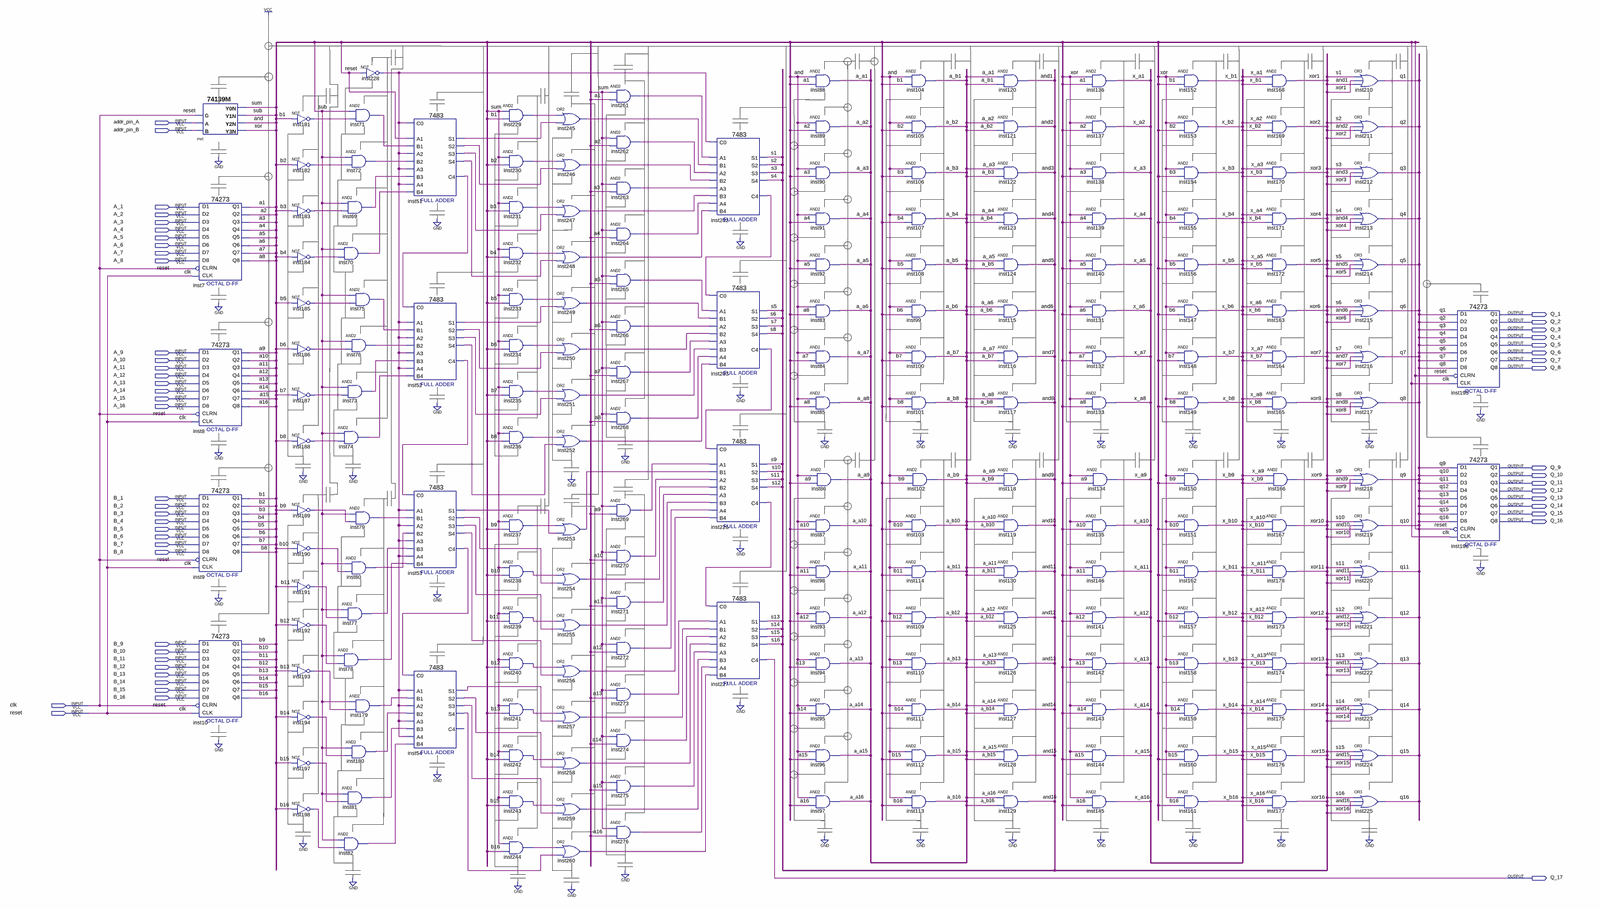
[diagram p0: schematic sheet, whole]
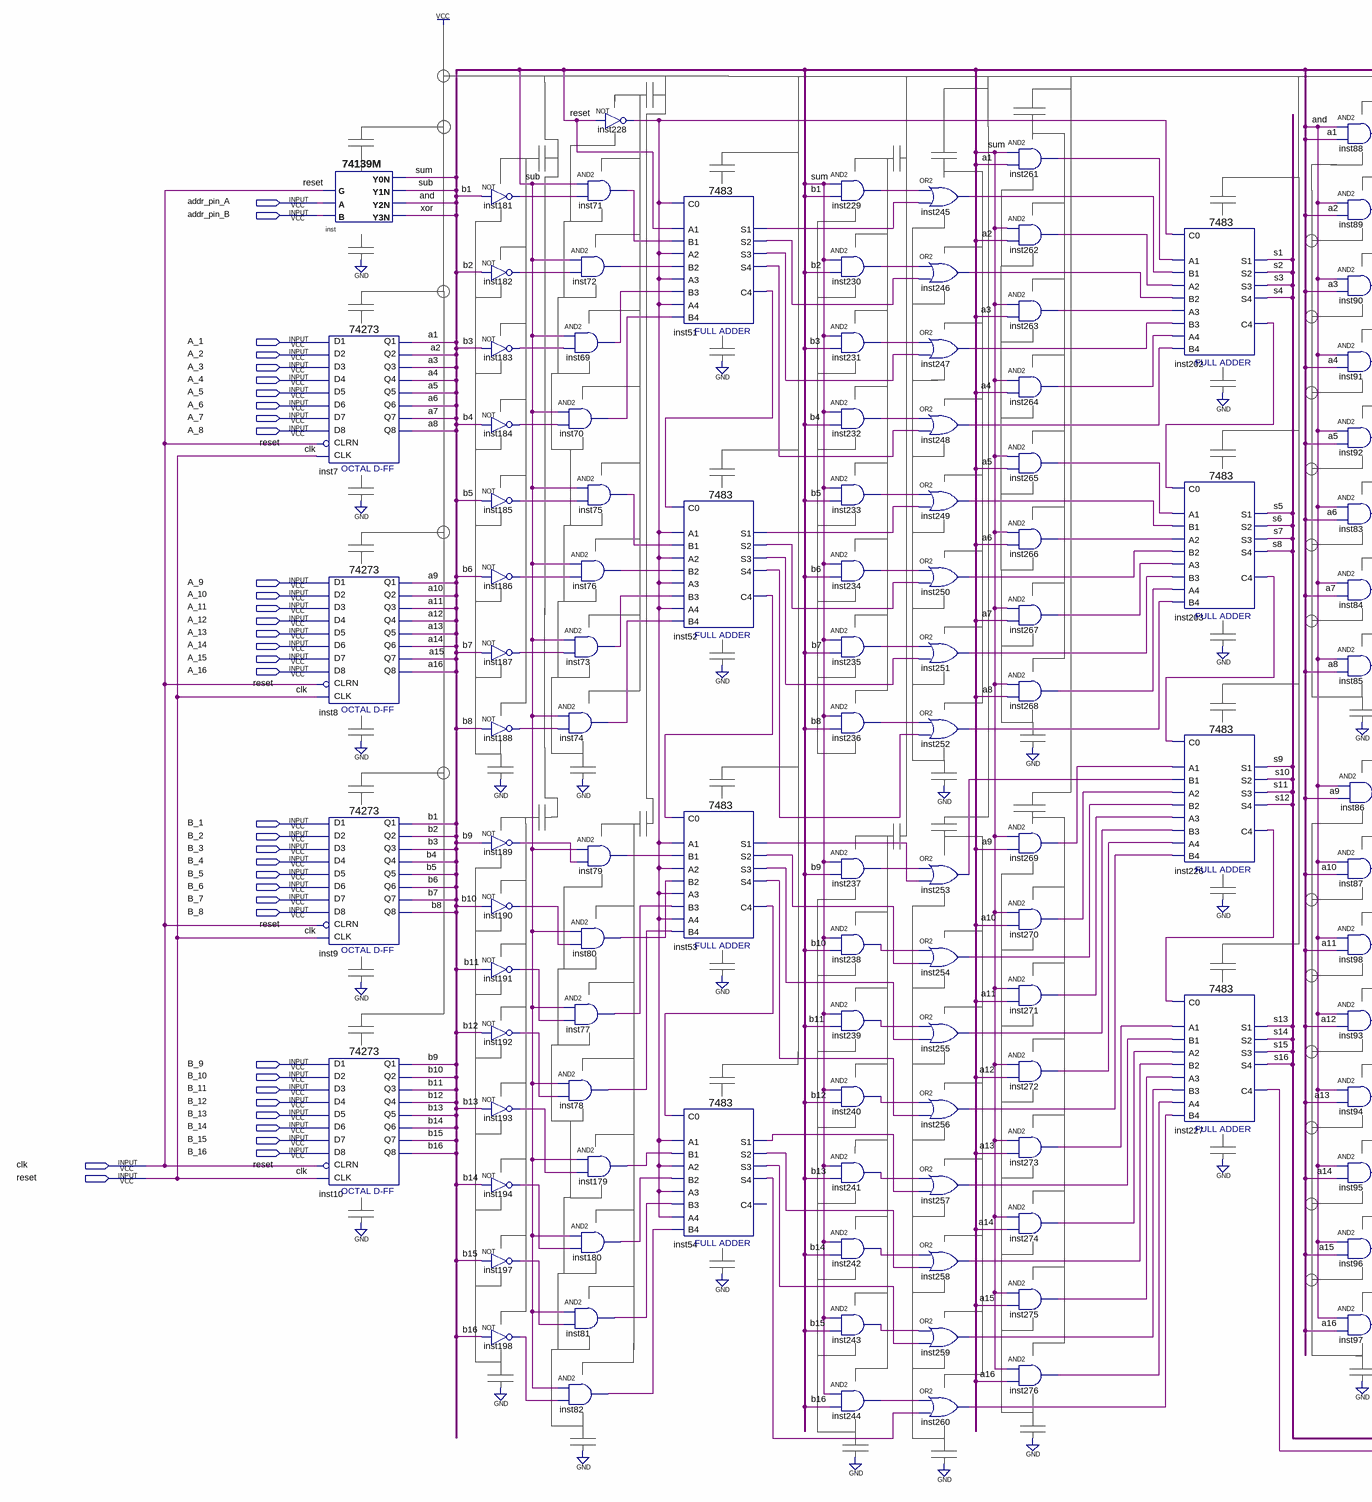
[diagram p1: schematic sheet, left part]
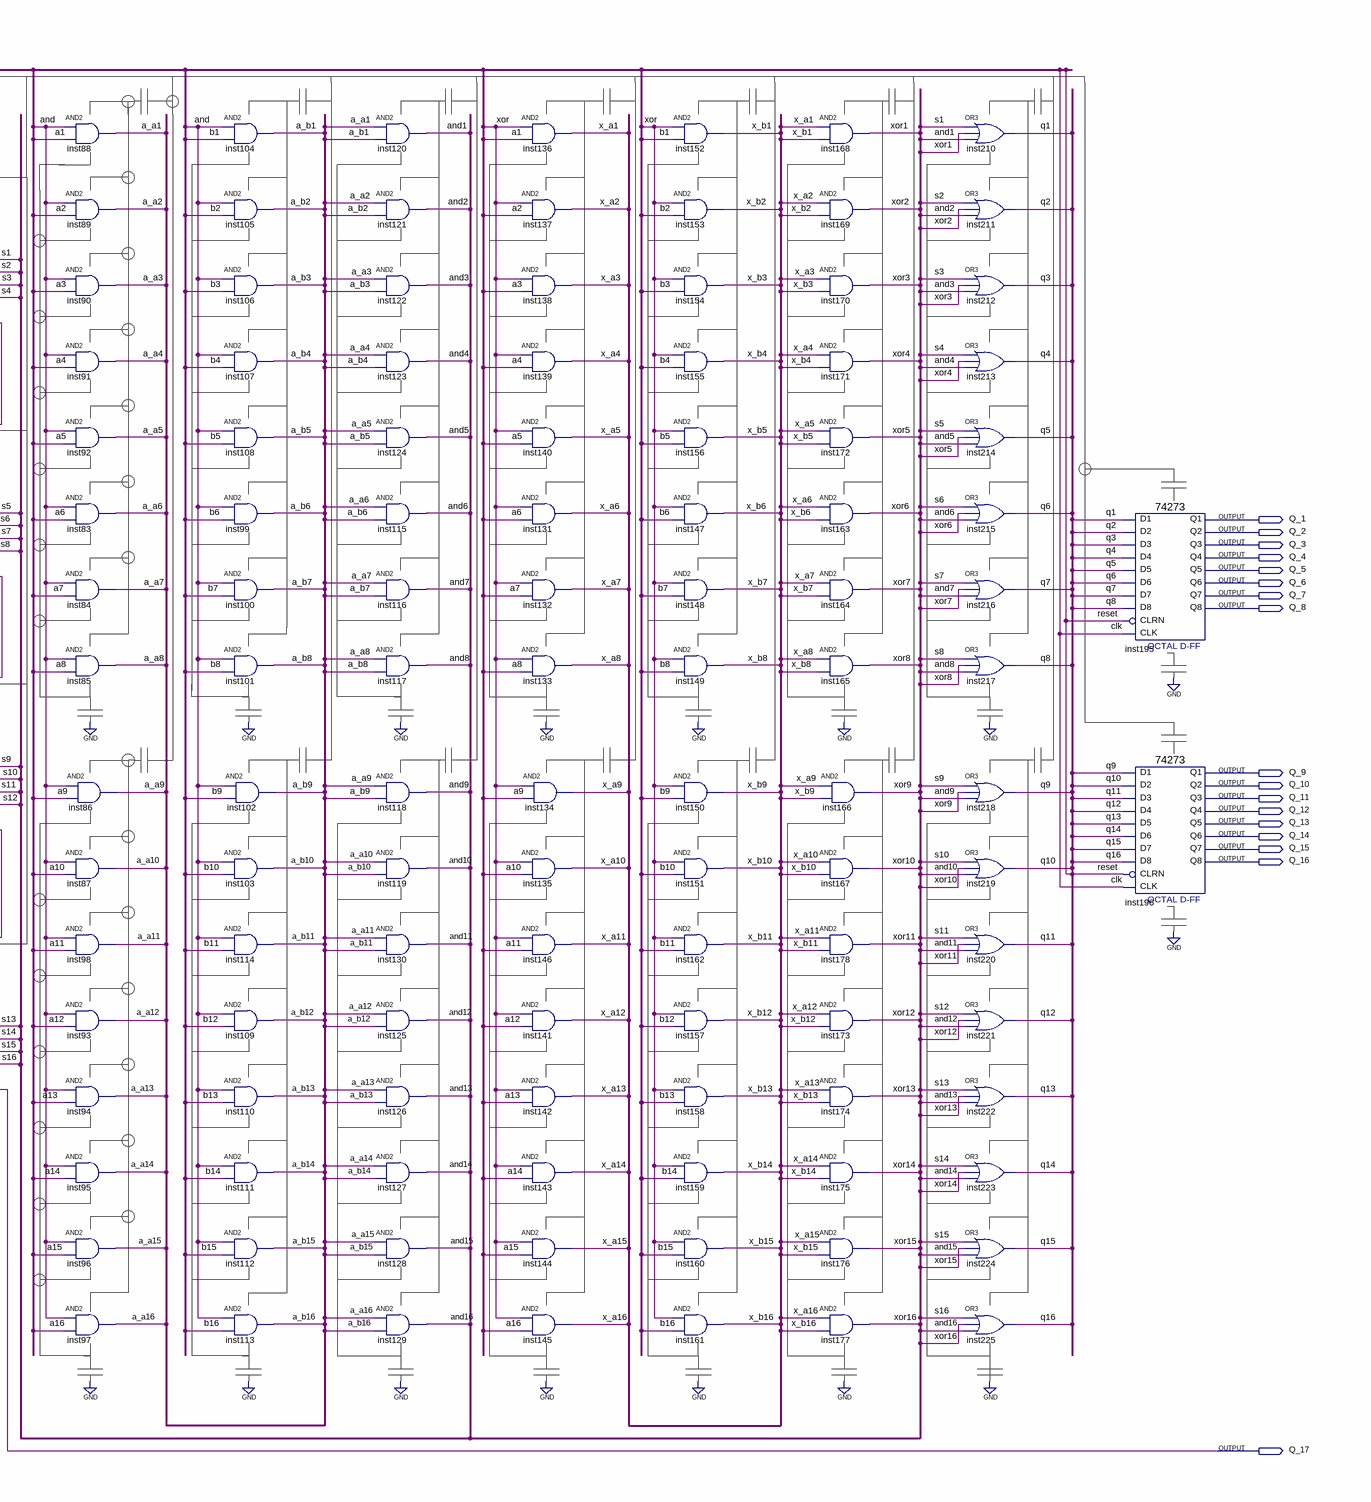
[diagram p2: schematic sheet, right part]
// Quartus schematic Приложение В.bdf as structural Verilog: 208 symbols, 53 pins
module \Приложение_В  (
  input  addr_pin_A,
  input  addr_pin_B,
  input  A_1,
  input  A_2,
  input  A_3,
  input  A_4,
  input  A_5,
  input  A_6,
  input  A_7,
  input  A_8,
  input  A_9,
  input  A_10,
  input  A_11,
  input  A_12,
  input  A_13,
  input  A_14,
  input  A_15,
  input  A_16,
  input  B_1,
  input  B_2,
  input  B_3,
  input  B_4,
  input  B_5,
  input  B_6,
  input  B_7,
  input  B_8,
  input  B_9,
  input  B_10,
  input  B_11,
  input  B_12,
  input  B_13,
  input  B_14,
  input  B_15,
  input  B_16,
  input  clk,
  input  reset,
  output Q_1,
  output Q_2,
  output Q_3,
  output Q_4,
  output Q_5,
  output Q_6,
  output Q_7,
  output Q_8,
  output Q_9,
  output Q_10,
  output Q_11,
  output Q_12,
  output Q_13,
  output Q_14,
  output Q_15,
  output Q_16,
  output Q_17
);

  wire a1, a2, a3, a4, a5, a6, a7, a8, a9, a10, a11, a12, a13, a14, a15, a16, a_a1, a_a2, a_a3, a_a4, a_a5,
       a_a6, a_a7, a_a8, a_a9, a_a10, a_a11, a_a12, a_a13, a_a14, a_a15, a_a16, a_b1, a_b2, a_b3, a_b4, a_b5,
       a_b6, a_b7, a_b8, a_b9, a_b10, a_b11, a_b12, a_b13, a_b14, a_b15, a_b16, \and , and1, and2, and3,
       and4, and5, and6, and7, and8, and9, and10, and11, and12, and13, and14, and15, and16, b1, b2, b3, b4,
       b5, b6, b7, b8, b9, b10, b11, b12, b13, b14, b15, b16, inst51_c4, inst51_s1, inst51_s2, inst51_s3,
       inst51_s4, inst52_c4, inst52_s1, inst52_s2, inst52_s3, inst52_s4, inst53_c4, inst53_s1, inst53_s2,
       inst53_s3, inst53_s4, inst54_s1, inst54_s2, inst54_s3, inst54_s4, inst69_out, inst70_out, inst71_out,
       inst72_out, inst73_out, inst74_out, inst75_out, inst76_out, inst77_out, inst78_out, inst79_out,
       inst80_out, inst81_out, inst82_out, inst179_out, inst180_out, inst181_out, inst182_out, inst183_out,
       inst184_out, inst185_out, inst186_out, inst187_out, inst188_out, inst189_out, inst190_out,
       inst191_out, inst192_out, inst193_out, inst194_out, inst197_out, inst198_out, inst202_c4, inst203_c4,
       inst226_c4, inst228_out, inst229_out, inst230_out, inst231_out, inst232_out, inst233_out, inst234_out,
       inst235_out, inst236_out, inst237_out, inst238_out, inst239_out, inst240_out, inst241_out,
       inst242_out, inst243_out, inst244_out, inst245_out, inst246_out, inst247_out, inst248_out,
       inst249_out, inst250_out, inst251_out, inst252_out, inst253_out, inst254_out, inst255_out,
       inst256_out, inst257_out, inst258_out, inst259_out, inst260_out, inst261_out, inst262_out,
       inst263_out, inst264_out, inst265_out, inst266_out, inst267_out, inst268_out, inst269_out,
       inst270_out, inst271_out, inst272_out, inst273_out, inst274_out, inst275_out, inst276_out, q1, q2, q3,
       q4, q5, q6, q7, q8, q9, q10, q11, q12, q13, q14, q15, q16, s1, s2, s3, s4, s5, s6, s7, s8, s9, s10,
       s11, s12, s13, s14, s15, s16, sub, sum, x_a1, x_a2, x_a3, x_a4, x_a5, x_a6, x_a7, x_a8, x_a9, x_a10,
       x_a11, x_a12, x_a13, x_a14, x_a15, x_a16, x_b1, x_b2, x_b3, x_b4, x_b5, x_b6, x_b7, x_b8, x_b9, x_b10,
       x_b11, x_b12, x_b13, x_b14, x_b15, x_b16, \xor , xor1, xor2, xor3, xor4, xor5, xor6, xor7, xor8, xor9,
       xor10, xor11, xor12, xor13, xor14, xor15, xor16;

  \74139M  inst (.B(addr_pin_B), .A(addr_pin_A), .G(clk), .Y3N(\xor ), .Y2N(\and ), .Y0N(sum), .Y1N(sub));
  \74273  inst7 (
    .D2(A_2), .D3(A_3), .D1(A_1), .D4(A_4), .D7(A_7), .D6(A_6), .D5(A_5), .D8(A_8), .CLK(clk), .CLRN(clk),
    .Q4(a4), .Q1(a1), .Q2(a2), .Q3(a3), .Q6(a6), .Q5(a5), .Q7(a7), .Q8(a8));
  \74273  inst8 (
    .D2(A_10), .D3(A_11), .D1(A_9), .D4(A_12), .D7(A_15), .D6(A_14), .D5(A_13), .D8(A_16), .CLK(clk),
    .CLRN(clk), .Q4(a12), .Q1(a9), .Q2(a10), .Q3(a11), .Q6(a14), .Q5(a13), .Q7(a15), .Q8(a16));
  \74273  inst9 (
    .D2(B_2), .D3(B_3), .D1(B_1), .D4(B_4), .D7(B_7), .D6(B_6), .D5(B_5), .D8(B_8), .CLK(clk), .CLRN(clk),
    .Q4(b4), .Q1(b1), .Q2(b2), .Q3(b3), .Q6(b6), .Q5(b5), .Q7(b7), .Q8(b8));
  \74273  inst10 (
    .D2(B_10), .D3(B_11), .D1(B_9), .D4(B_12), .D7(B_15), .D6(B_14), .D5(B_13), .D8(B_16), .CLK(clk),
    .CLRN(clk), .Q4(b12), .Q1(b9), .Q2(b10), .Q3(b11), .Q6(b14), .Q5(b13), .Q7(b15), .Q8(b16));
  not inst181 (inst181_out, b1);
  not inst182 (inst182_out, b2);
  not inst183 (inst183_out, b3);
  not inst184 (inst184_out, b4);
  not inst185 (inst185_out, b5);
  not inst186 (inst186_out, b6);
  not inst187 (inst187_out, b7);
  not inst188 (inst188_out, b8);
  not inst189 (inst189_out, b9);
  not inst190 (inst190_out, b10);
  not inst191 (inst191_out, b11);
  not inst192 (inst192_out, b12);
  not inst193 (inst193_out, b13);
  not inst194 (inst194_out, b14);
  not inst197 (inst197_out, b15);
  not inst198 (inst198_out, b16);
  and inst71 (inst71_out, sub, inst181_out);
  and inst72 (inst72_out, sub, inst182_out);
  and inst69 (inst69_out, sub, inst183_out);
  and inst70 (inst70_out, sub, inst184_out);
  and inst75 (inst75_out, sub, inst185_out);
  and inst76 (inst76_out, sub, inst186_out);
  and inst73 (inst73_out, sub, inst187_out);
  and inst74 (inst74_out, sub, inst188_out);
  and inst79 (inst79_out, sub, inst189_out);
  and inst80 (inst80_out, sub, inst190_out);
  and inst77 (inst77_out, sub, inst191_out);
  and inst78 (inst78_out, sub, inst192_out);
  and inst179 (inst179_out, sub, inst193_out);
  and inst180 (inst180_out, sub, inst194_out);
  and inst81 (inst81_out, sub, inst197_out);
  and inst82 (inst82_out, sub, inst198_out);
  not inst228 (inst228_out, clk);
  \7483  inst51 (
    .B4(inst70_out), .C0(inst228_out), .A1(clk), .A2(inst228_out), .B1(inst71_out), .B2(inst72_out),
    .A3(inst228_out), .B3(inst69_out), .A4(inst228_out), .S3(inst51_s3), .S4(inst51_s4), .S2(inst51_s2),
    .C4(inst51_c4), .S1(inst51_s1));
  \7483  inst52 (
    .B4(inst74_out), .C0(inst51_c4), .A1(inst228_out), .A2(inst228_out), .B1(inst75_out), .B2(inst76_out),
    .A3(inst228_out), .B3(inst73_out), .A4(inst228_out), .S3(inst52_s3), .S4(inst52_s4), .S2(inst52_s2),
    .C4(inst52_c4), .S1(inst52_s1));
  \7483  inst53 (
    .B4(inst78_out), .C0(inst52_c4), .A1(inst228_out), .A2(inst228_out), .B1(inst79_out), .B2(inst80_out),
    .A3(inst228_out), .B3(inst77_out), .A4(inst228_out), .S3(inst53_s3), .S4(inst53_s4), .S2(inst53_s2),
    .C4(inst53_c4), .S1(inst53_s1));
  \7483  inst54 (
    .B4(inst82_out), .C0(inst53_c4), .A1(inst228_out), .A2(inst228_out), .B1(inst179_out), .B2(inst180_out),
    .A3(inst228_out), .B3(inst81_out), .A4(inst228_out), .S3(inst54_s3), .S4(inst54_s4), .S2(inst54_s2),
    .S1(inst54_s1));  // open: C4
  and inst229 (inst229_out, sum, b1);
  and inst230 (inst230_out, sum, b2);
  and inst231 (inst231_out, sum, b3);
  and inst232 (inst232_out, sum, b4);
  and inst233 (inst233_out, sum, b5);
  and inst234 (inst234_out, sum, b6);
  and inst235 (inst235_out, sum, b7);
  and inst236 (inst236_out, sum, b8);
  and inst237 (inst237_out, sum, b9);
  and inst238 (inst238_out, sum, b10);
  and inst239 (inst239_out, sum, b11);
  and inst240 (inst240_out, sum, b12);
  and inst241 (inst241_out, sum, b13);
  and inst242 (inst242_out, sum, b14);
  and inst243 (inst243_out, sum, b15);
  and inst244 (inst244_out, sum, b16);
  or inst245 (inst245_out, inst229_out, inst51_s1);
  or inst246 (inst246_out, inst230_out, inst51_s2);
  or inst247 (inst247_out, inst231_out, inst51_s3);
  or inst248 (inst248_out, inst232_out, inst51_s4);
  or inst249 (inst249_out, inst233_out, inst52_s1);
  or inst250 (inst250_out, inst234_out, inst52_s2);
  or inst251 (inst251_out, inst235_out, inst52_s3);
  or inst252 (inst252_out, inst236_out, inst52_s4);
  or inst253 (inst253_out, inst237_out, inst53_s1);
  or inst254 (inst254_out, inst238_out, inst53_s2);
  or inst255 (inst255_out, inst239_out, inst53_s3);
  or inst256 (inst256_out, inst240_out, inst53_s4);
  or inst257 (inst257_out, inst241_out, inst54_s1);
  or inst258 (inst258_out, inst242_out, inst54_s2);
  or inst259 (inst259_out, inst243_out, inst54_s3);
  or inst260 (inst260_out, inst244_out, inst54_s4);
  and inst261 (inst261_out, sum, a1);
  and inst262 (inst262_out, sum, a2);
  and inst263 (inst263_out, sum, a3);
  and inst264 (inst264_out, sum, a4);
  and inst265 (inst265_out, sum, a5);
  and inst266 (inst266_out, sum, a6);
  and inst267 (inst267_out, sum, a7);
  and inst268 (inst268_out, sum, a8);
  and inst269 (inst269_out, sum, a9);
  and inst270 (inst270_out, sum, a10);
  and inst271 (inst271_out, sum, a11);
  and inst272 (inst272_out, sum, a12);
  and inst273 (inst273_out, sum, a13);
  and inst274 (inst274_out, sum, a14);
  and inst275 (inst275_out, sum, a15);
  and inst276 (inst276_out, sum, a16);
  \7483  inst202 (
    .B4(inst248_out), .C0(inst228_out), .A1(inst261_out), .A2(inst262_out), .B1(inst245_out),
    .B2(inst246_out), .A3(inst263_out), .B3(inst247_out), .A4(inst264_out), .S3(s3), .S4(s4), .S2(s2),
    .C4(inst202_c4), .S1(s1));
  \7483  inst203 (
    .B4(inst252_out), .C0(inst202_c4), .A1(inst265_out), .A2(inst266_out), .B1(inst249_out),
    .B2(inst250_out), .A3(inst267_out), .B3(inst251_out), .A4(inst268_out), .S3(s7), .S4(s8), .S2(s6),
    .C4(inst203_c4), .S1(s5));
  \7483  inst226 (
    .B4(inst256_out), .C0(inst203_c4), .A1(inst269_out), .A2(inst270_out), .B1(inst253_out),
    .B2(inst254_out), .A3(inst271_out), .B3(inst255_out), .A4(inst272_out), .S3(s11), .S4(s12), .S2(s10),
    .C4(inst226_c4), .S1(s9));
  \7483  inst227 (
    .B4(inst260_out), .C0(inst226_c4), .A1(inst273_out), .A2(inst274_out), .B1(inst257_out),
    .B2(inst258_out), .A3(inst275_out), .B3(inst259_out), .A4(inst276_out), .S3(s15), .S4(s16), .S2(s14),
    .C4(Q_17), .S1(s13));
  and inst88 (a_a1, \and , a1);
  and inst89 (a_a2, \and , a2);
  and inst90 (a_a3, \and , a3);
  and inst91 (a_a4, \and , a4);
  and inst92 (a_a5, \and , a5);
  and inst83 (a_a6, \and , a6);
  and inst84 (a_a7, \and , a7);
  and inst85 (a_a8, \and , a8);
  and inst86 (a_a9, \and , a9);
  and inst87 (a_a10, \and , a10);
  and inst98 (a_a11, \and , a11);
  and inst93 (a_a12, \and , a12);
  and inst94 (a_a13, \and , a13);
  and inst95 (a_a14, \and , a14);
  and inst96 (a_a15, \and , a15);
  and inst97 (a_a16, \and , a16);
  and inst104 (a_b1, \and , b1);
  and inst105 (a_b2, \and , b2);
  and inst106 (a_b3, \and , b3);
  and inst107 (a_b4, \and , b4);
  and inst108 (a_b5, \and , b5);
  and inst99 (a_b6, \and , b6);
  and inst100 (a_b7, \and , b7);
  and inst101 (a_b8, \and , b8);
  and inst102 (a_b9, \and , b9);
  and inst103 (a_b10, \and , b10);
  and inst114 (a_b11, \and , b11);
  and inst109 (a_b12, \and , b12);
  and inst110 (a_b13, \and , b13);
  and inst111 (a_b14, \and , b14);
  and inst112 (a_b15, \and , b15);
  and inst113 (a_b16, \and , b16);
  and inst120 (and1, a_a1, a_b1);
  and inst121 (and2, a_a2, a_b2);
  and inst122 (and3, a_a3, a_b3);
  and inst123 (and4, a_a4, a_b4);
  and inst124 (and5, a_a5, a_b5);
  and inst115 (and6, a_a6, a_b6);
  and inst116 (and7, a_a7, a_b7);
  and inst117 (and8, a_a8, a_b8);
  and inst118 (and9, a_a9, a_b9);
  and inst119 (and10, a_a10, a_b10);
  and inst130 (and11, a_a11, a_b11);
  and inst125 (and12, a_a12, a_b12);
  and inst126 (and13, a_a13, a_b13);
  and inst127 (and14, a_a14, a_b14);
  and inst128 (and15, a_a15, a_b15);
  and inst129 (and16, a_a16, a_b16);
  and inst136 (x_a1, \xor , a1);
  and inst137 (x_a2, \xor , a2);
  and inst138 (x_a3, \xor , a3);
  and inst139 (x_a4, \xor , a4);
  and inst140 (x_a5, \xor , a5);
  and inst131 (x_a6, \xor , a6);
  and inst132 (x_a7, \xor , a7);
  and inst133 (x_a8, \xor , a8);
  and inst134 (x_a9, \xor , a9);
  and inst135 (x_a10, \xor , a10);
  and inst146 (x_a11, \xor , a11);
  and inst141 (x_a12, \xor , a12);
  and inst142 (x_a13, \xor , a13);
  and inst143 (x_a14, \xor , a14);
  and inst144 (x_a15, \xor , a15);
  and inst145 (x_a16, \xor , a16);
  and inst152 (x_b1, \xor , b1);
  and inst153 (x_b2, \xor , b2);
  and inst154 (x_b3, \xor , b3);
  and inst155 (x_b4, \xor , b4);
  and inst156 (x_b5, \xor , b5);
  and inst147 (x_b6, \xor , b6);
  and inst148 (x_b7, \xor , b7);
  and inst149 (x_b8, \xor , b8);
  and inst150 (x_b9, \xor , b9);
  and inst151 (x_b10, \xor , b10);
  and inst162 (x_b11, \xor , b11);
  and inst157 (x_b12, \xor , b12);
  and inst158 (x_b13, \xor , b13);
  and inst159 (x_b14, \xor , b14);
  and inst160 (x_b15, \xor , b15);
  and inst161 (x_b16, \xor , b16);
  and inst168 (xor1, x_a1, x_b1);
  and inst169 (xor2, x_a2, x_b2);
  and inst170 (xor3, x_a3, x_b3);
  and inst171 (xor4, x_a4, x_b4);
  and inst172 (xor5, x_a5, x_b5);
  and inst163 (xor6, x_a6, x_b6);
  and inst164 (xor7, x_a7, x_b7);
  and inst165 (xor8, x_a8, x_b8);
  and inst166 (xor9, x_a9, x_b9);
  and inst167 (xor10, x_a10, x_b10);
  and inst178 (xor11, x_a11, x_b11);
  and inst173 (xor12, x_a12, x_b12);
  and inst174 (xor13, x_a13, x_b13);
  and inst175 (xor14, x_a14, x_b14);
  and inst176 (xor15, x_a15, x_b15);
  and inst177 (xor16, x_a16, x_b16);
  or inst210 (q1, s1, xor1, and1);
  or inst211 (q2, s2, xor2, and2);
  or inst212 (q3, s3, xor3, and3);
  or inst213 (q4, s4, xor4, and4);
  or inst214 (q5, s5, xor5, and5);
  or inst215 (q6, s6, xor6, and6);
  or inst216 (q7, s7, xor7, and7);
  or inst217 (q8, s8, xor8, and8);
  or inst218 (q9, s9, xor9, and9);
  or inst219 (q10, s10, xor10, and10);
  or inst220 (q11, s11, xor11, and11);
  or inst221 (q12, s12, xor12, and12);
  or inst222 (q13, s13, xor13, and13);
  or inst223 (q14, s14, xor14, and14);
  or inst224 (q15, s15, xor15, and15);
  or inst225 (q16, s16, xor16, and16);
  \74273  inst195 (
    .D2(q2), .D3(q3), .D1(q1), .D4(q4), .D7(q7), .D6(q6), .D5(q5), .D8(q8), .CLK(clk), .CLRN(clk), .Q4(Q_4),
    .Q1(Q_1), .Q2(Q_2), .Q3(Q_3), .Q6(Q_6), .Q5(Q_5), .Q7(Q_7), .Q8(Q_8));
  \74273  inst196 (
    .D2(q10), .D3(q11), .D1(q9), .D4(q12), .D7(q15), .D6(q14), .D5(q13), .D8(q16), .CLK(clk), .CLRN(clk),
    .Q4(Q_12), .Q1(Q_9), .Q2(Q_10), .Q3(Q_11), .Q6(Q_14), .Q5(Q_13), .Q7(Q_15), .Q8(Q_16));

  assign reset = clk;
endmodule
